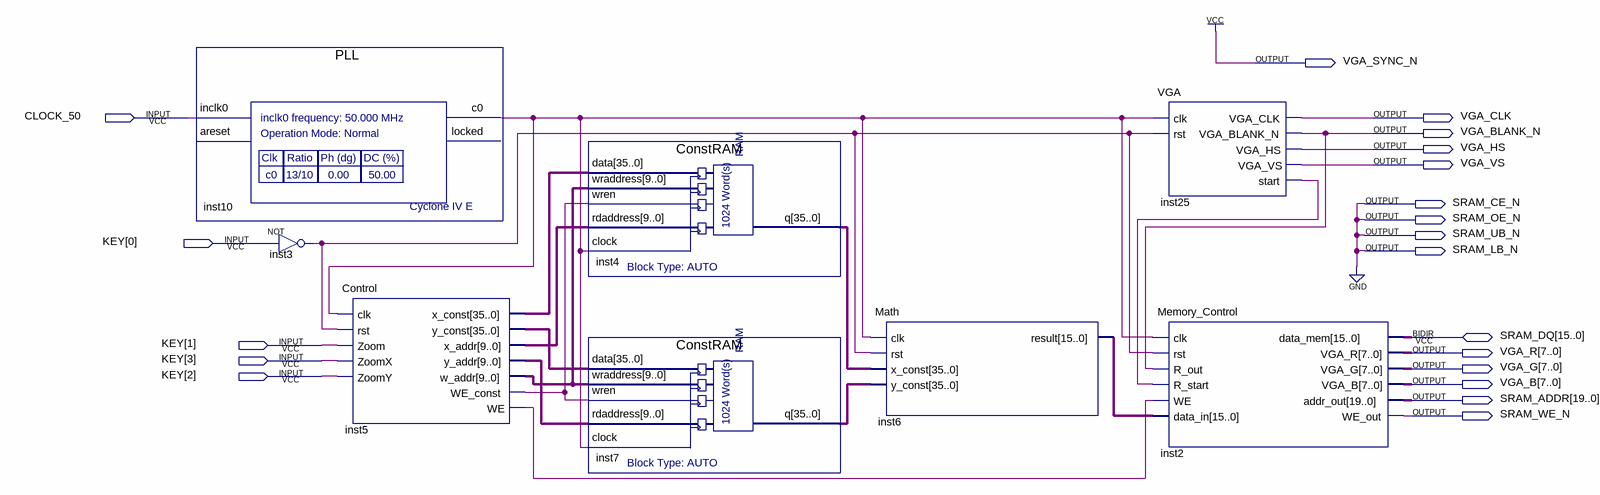
[diagram p0: schematic sheet]
// Quartus schematic Fractal.bdf as structural Verilog: 8 symbols, 20 pins
module Fractal (
  input  CLOCK_50,
  input  [3:0] KEY,
  inout  [15:0] SRAM_DQ,
  output VGA_SYNC_N,
  output VGA_CLK,
  output VGA_BLANK_N,
  output VGA_HS,
  output VGA_VS,
  output SRAM_CE_N,
  output SRAM_OE_N,
  output SRAM_UB_N,
  output SRAM_LB_N,
  output [7:0] VGA_R,
  output [7:0] VGA_G,
  output [7:0] VGA_B,
  output [19:0] SRAM_ADDR,
  output SRAM_WE_N
);

  wire inst3_out, inst5_we, inst5_we_const, inst10_c0, inst25_start;
  wire [9:0] inst5_w_addr, inst5_x_addr, inst5_y_addr;
  wire [15:0] inst6_result;
  wire [35:0] inst4_q, inst5_x_const, inst5_y_const, inst7_q;

  PLL inst10 (.inclk0(CLOCK_50), .c0(inst10_c0));  // open: areset, locked
  not inst3 (inst3_out, KEY[0]);
  Control inst5 (
    .clk(inst10_c0), .rst(inst3_out), .Zoom(KEY[1]), .ZoomX(KEY[3]), .ZoomY(KEY[2]), .x_const(inst5_x_const),
    .y_const(inst5_y_const), .x_addr(inst5_x_addr), .y_addr(inst5_y_addr), .w_addr(inst5_w_addr),
    .WE_const(inst5_we_const), .WE(inst5_we));
  ConstRAM inst4 (
    .data(inst5_x_const), .wraddress(inst5_w_addr), .wren(inst5_we_const), .rdaddress(inst5_x_addr),
    .clock(inst10_c0), .q(inst4_q));
  ConstRAM inst7 (
    .data(inst5_y_const), .wraddress(inst5_w_addr), .wren(inst5_we_const), .rdaddress(inst5_y_addr),
    .clock(inst10_c0), .q(inst7_q));
  Math inst6 (.clk(inst10_c0), .rst(inst3_out), .x_const(inst4_q), .y_const(inst7_q), .result(inst6_result));
  VGA inst25 (
    .clk(inst10_c0), .rst(inst3_out), .VGA_CLK(VGA_CLK), .VGA_BLANK_N(VGA_BLANK_N), .VGA_HS(VGA_HS),
    .VGA_VS(VGA_VS), .start(inst25_start));
  Memory_Control inst2 (
    .clk(inst10_c0), .rst(inst3_out), .R_out(VGA_BLANK_N), .R_start(inst25_start), .WE(inst5_we),
    .data_in(inst6_result), .VGA_R(VGA_R), .VGA_G(VGA_G), .VGA_B(VGA_B), .addr_out(SRAM_ADDR),
    .WE_out(SRAM_WE_N), .data_mem(SRAM_DQ));

  assign SRAM_CE_N = 1'b0;
  assign SRAM_LB_N = 1'b0;
  assign SRAM_OE_N = 1'b0;
  assign SRAM_UB_N = 1'b0;
  assign VGA_SYNC_N = 1'b1;
endmodule
